# EAGLE design kilafors_rev_B (EAGLE 6.6.0)
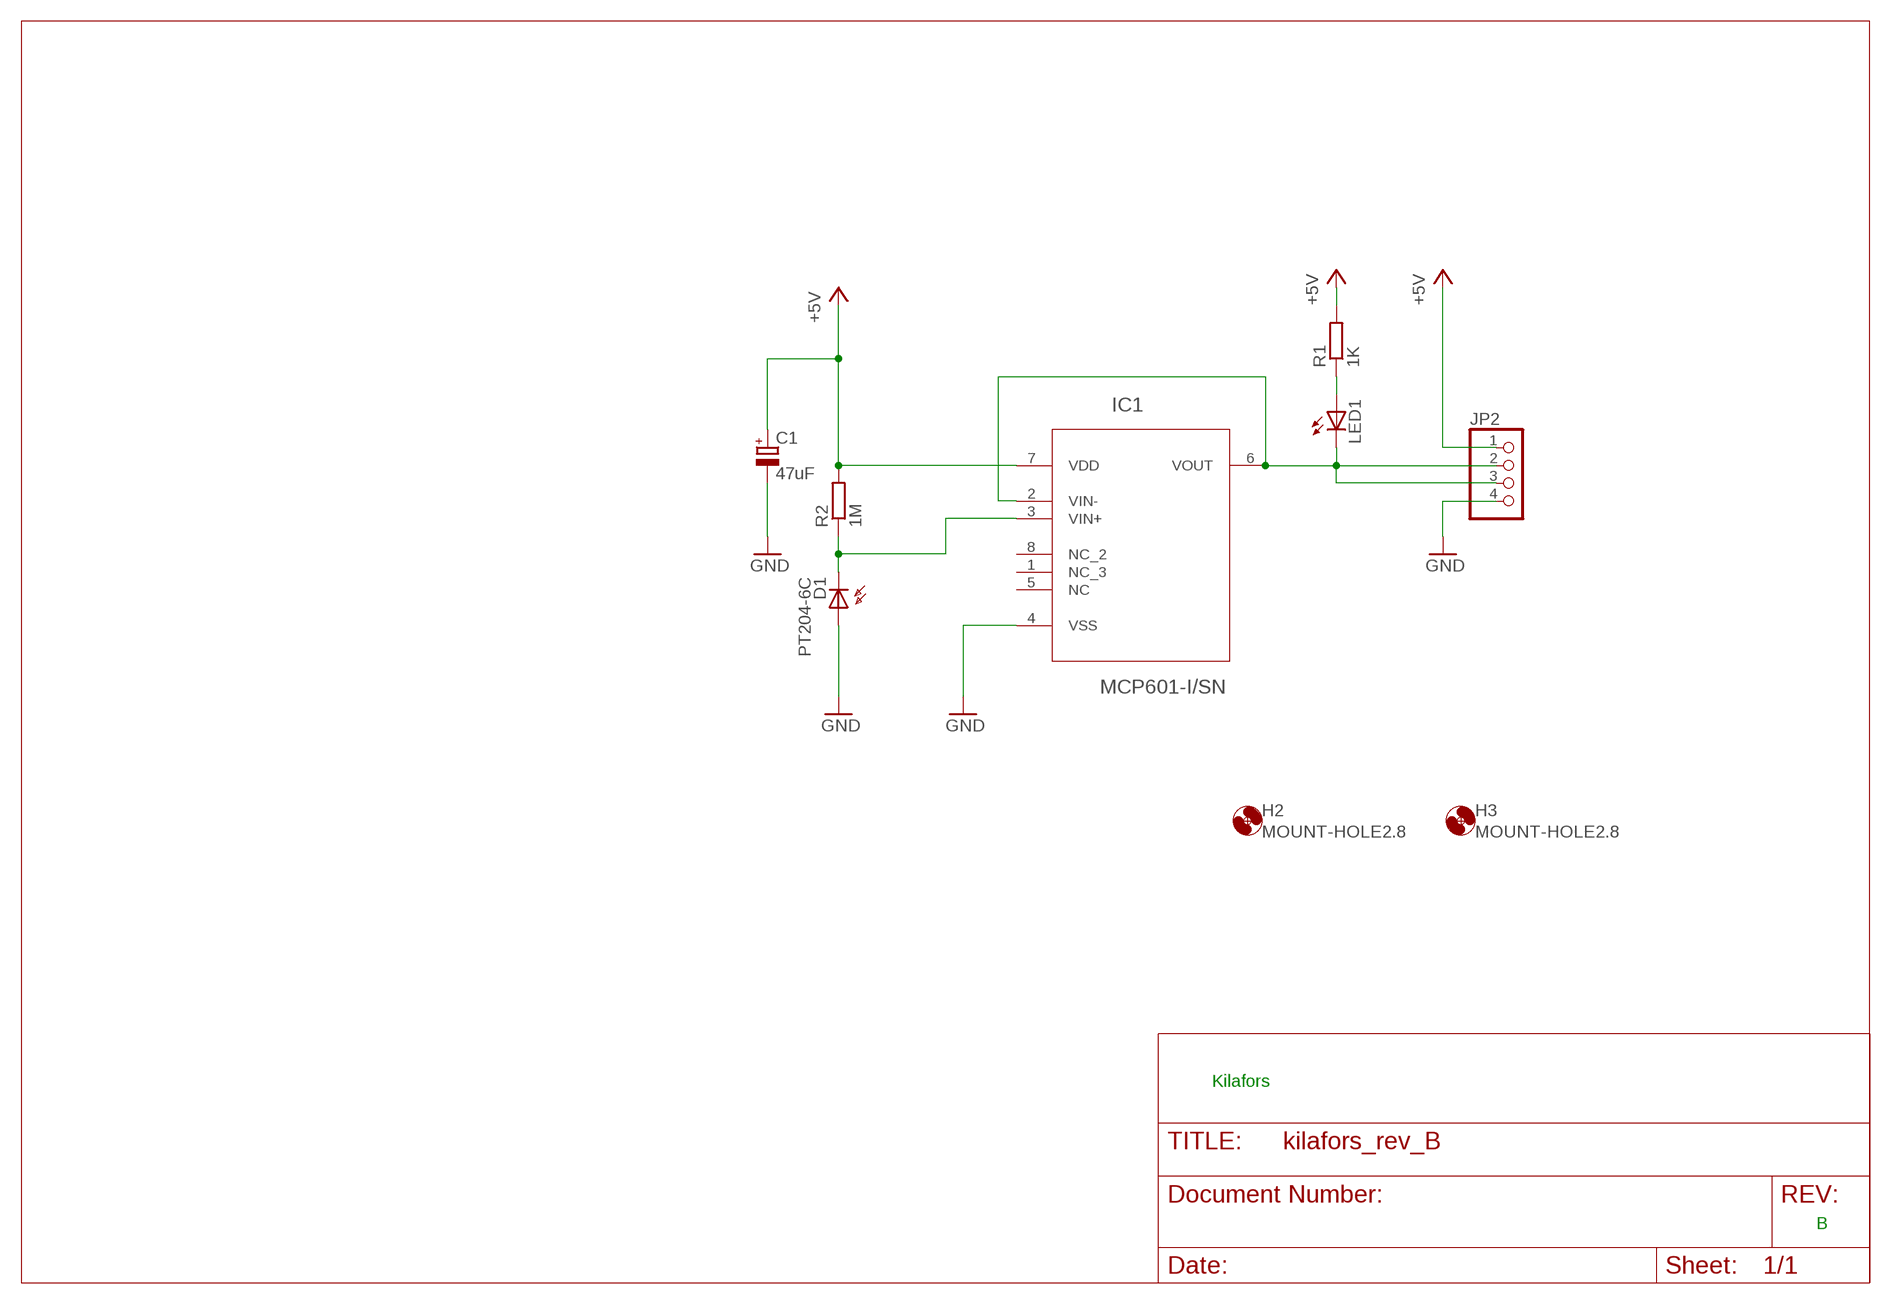
[diagram p0: schematic, sheet 1]

## Parts
C1  47uF  CPOL-EUE5-5  [E5-5]
D1  PT204-6C  BPW32  [BPW32]
H2  MOUNT-HOLE2.8  [2,8]
H3  MOUNT-HOLE2.8  [2,8]
IC1  MCP601-I/SN  [SOIC127P600X175-8N]
JP2  PINHD-1X4  [1X04]
LED1  LED3MM  [LED3MM]
R1  1K  R-EU_0204/5  [0204/5]
R2  1M  R-EU_0204/5  [0204/5]

## Nets
+5V: C1.+ IC1.7(VDD) JP2.1 R1.2 R2.2
GND: C1.- D1.A IC1.4(VSS) JP2.4
N$1: IC1.2(VIN-) IC1.6(VOUT) JP2.2 JP2.3 LED1.K(C)
N$3: D1.K(C) IC1.3(VIN+) R2.1
N$6: LED1.A R1.1
Unconnected: IC1.1(NC_3) IC1.5(NC) IC1.8(NC_2)

## Notes on the sheet
- Kilafors
- B

## Library data of the parts
C1 = rcl:CPOL-EU: POLARIZED CAPACITOR, European symbol
D1 = opto-trans-siemens:BPW32: PHOTO DIODE; OC_FARNELL: unknown; OC_NEWARK: unknown
H2 H3 = holes:MOUNT-HOLE: MOUNTING HOLE with drill center marker
IC1 = mcp601:MCP601-I/SN: CMOS Op Amp; DESCRIPTION: CMOS Op Amps; MPN: MCP601-I/SN; OC_FARNELL: 9758623; OC_NEWARK: 61K2952; PACKAGE: SOIC-8; SUPPLIER: Microchip
JP2 = pinhead:PINHD-1X4: PIN HEADER
LED1 = led:LED: LED OSRAM: - CHIPLED LG R971, LG N971, LY N971, LG Q971, LY Q971, LO R971, LY R971 LH N974, LH R974 LS Q976, LO Q976, LY Q976 LO Q996 - Hyper CHIPLED LW Q18S LB Q993, LB Q99A, LB R99A - SideLED LS A670, LO A670, LY A670, LG A670, LP A670 LB A673, LV A673, LT A673, LW A673 LH A674 LY A675 LS A676, LA A676, LO A676, LY A676, LW A676 LS A679, LY A679, LG A679 - Hyper Micro SIDELED® LS Y876, LA Y876, LO Y876, LY Y876 LT Y87S - SmartLED LW L88C, LW L88S LB L89C, LB L89S, LG L890 LS L89K, LO L89K, LY L89K LS L896, LA L896, LO L896, LY L896 - TOPLED LS T670, LO T670, LY T670, LG T670, LP T670 LSG T670, LSP T670, LSY T670, LOP T670, LYG T670 LG T671, LOG T671, LSG T671 LB T673, LV T673, LT T673, LW T673 LH T674 LS T676, LA T676, LO T676, LY T676, LB T676, LH T676, LSB T676, LW T676 LB T67C, LV T67C, LT T67C, LS T67K, LO T67K, LY T67K, LW E67C LS E67B, LA E67B, LO E67B, LY E67B, LB E67C, LV E67C, LT E67C LW T67C LS T679, LY T679, LG T679 LS T770, LO T770, LY T770, LG T770, LP T770 LB T773, LV T773, LT T773, LW T773 LH T774 LS E675, LA E675, LY E675, LS T675 LS T776, LA T776, LO T776, LY T776, LB T776 LHGB T686 LT T68C, LB T68C - Hyper Mini TOPLED® LB M676 - Mini TOPLED Santana® LG M470 LS M47K, LO M47K, LY M47K Source: http://www.osram.convergy.de LUXEON: - LUMILED® LXK2-PW12-R00, LXK2-PW12-S00, LXK2-PW14-U00, LXK2-PW14-V00 LXK2-PM12-R00, LXK2-PM12-S00, LXK2-PM14-U00 LXK2-PE12-Q00, LXK2-PE12-R00, LXK2-PE12-S00, LXK2-PE14-T00, LXK2-PE14-U00 LXK2-PB12-K00, LXK2-PB12-L00, LXK2-PB12-M00, LXK2-PB14-N00, LXK2-PB14-P00, LXK2-PB14-Q00 LXK2-PR12-L00, LXK2-PR12-M00, LXK2-PR14-Q00, LXK2-PR14-R00 LXK2-PD12-Q00, LXK2-PD12-R00, LXK2-PD12-S00 LXK2-PH12-R00, LXK2-PH12-S00 LXK2-PL12-P00, LXK2-PL12-Q00, LXK2-PL12-R00 Source: www.luxeon.com KINGBRIGHT: KA-3528ASYC Source: www.kingbright.com
R1 R2 = resistor:R-EU_: RESISTOR, European symbol

## Board
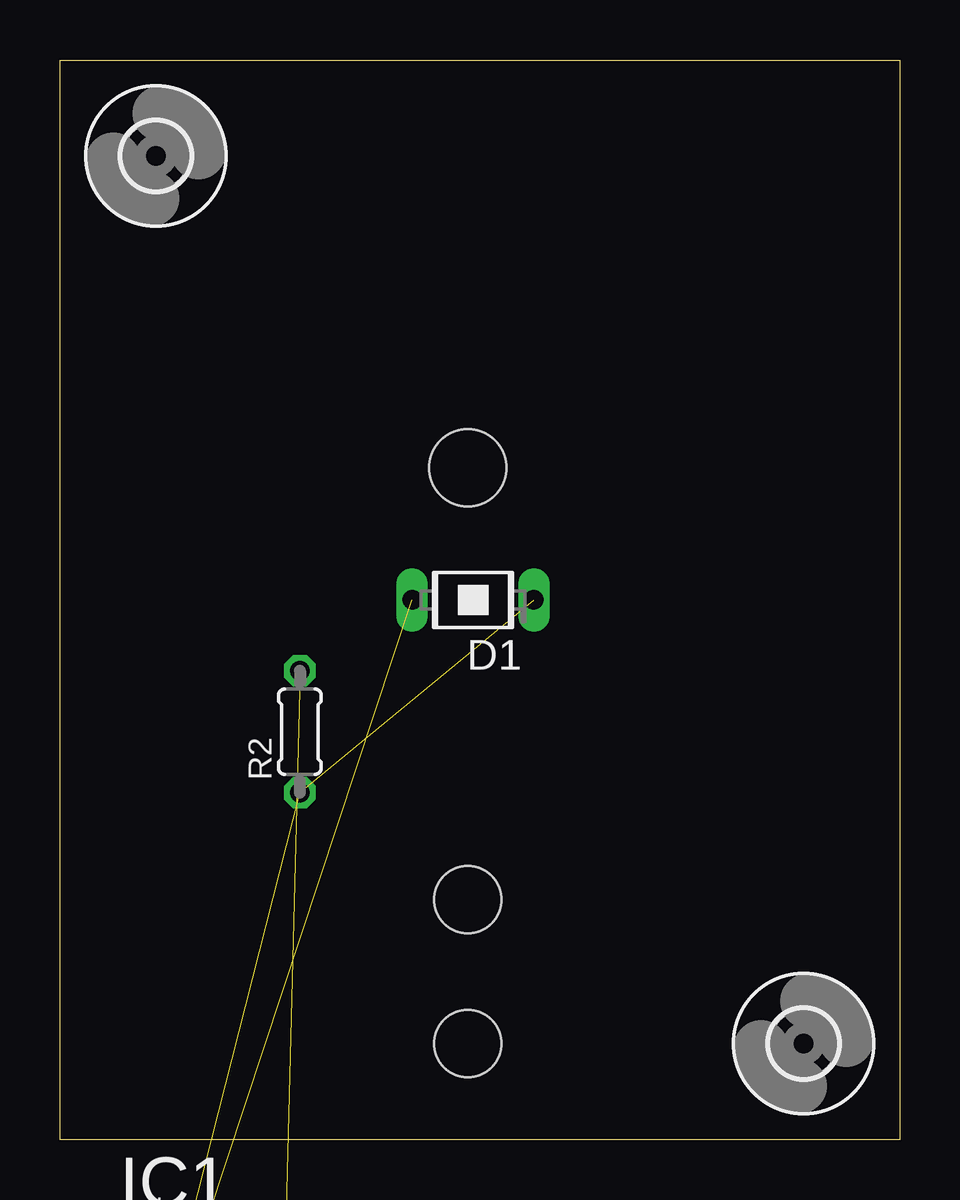
[diagram p1: board, top side]
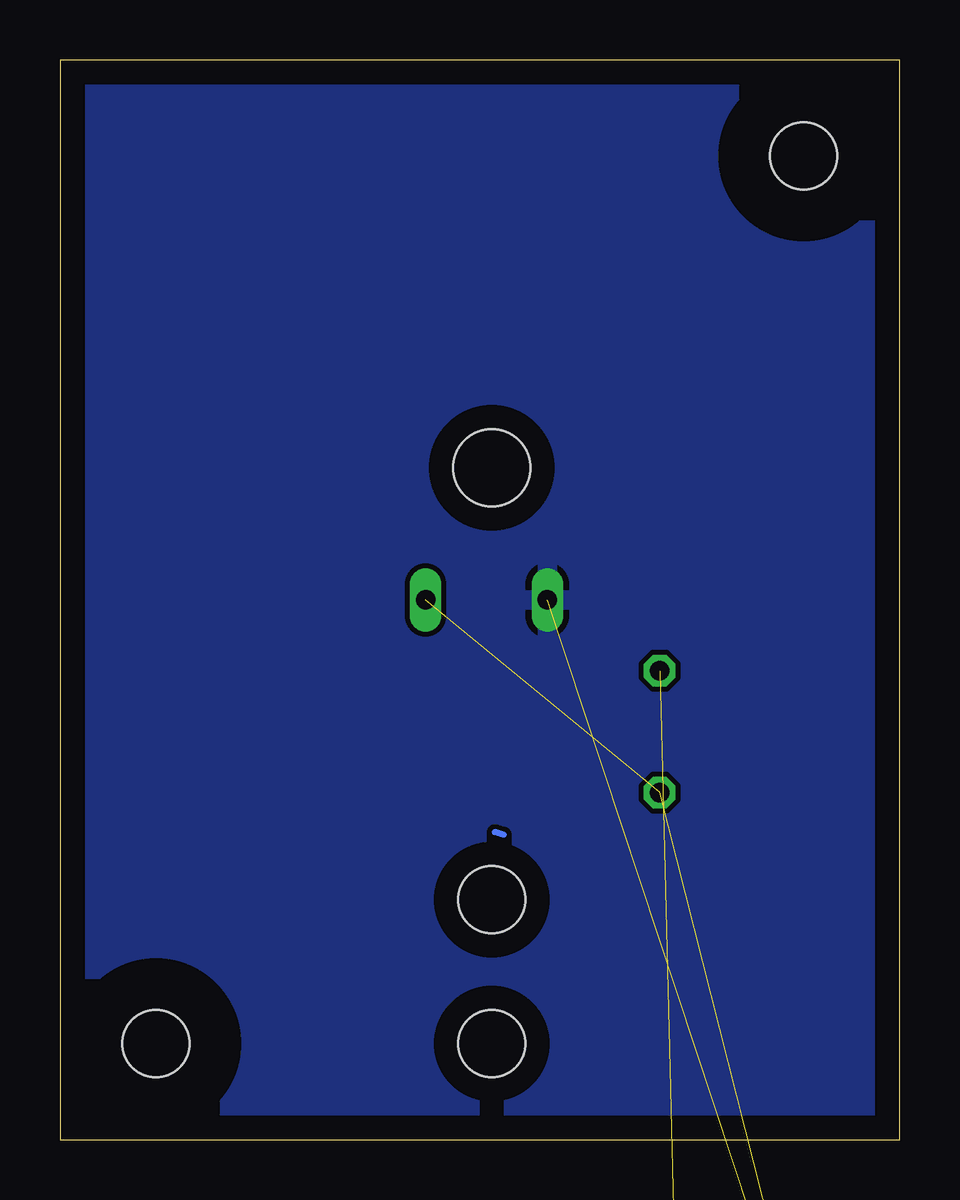
[diagram p2: board, bottom side, seen from below]

Size 35 x 45 mm. Coordinates in mm from the lower left corner, seen from the top.
Outline: 0,0 0,45 35,45 35,0 0,0
Copper layers (1*16): Top 0.035mm / dielectric 1.5mm / Bottom 0.035mm
Design rules "default": minimum track width 10mil, minimum drill 24mil, track to track 8mil, track to pad 8mil, pad to pad 8mil, via to via 8mil, smd to smd 8mil, copper to edge 40mil, drill to drill 8mil, minimum pad ring 10mil, minimum via ring 8mil, stop-mask expansion 4mil, vias tented up to drill 0mil, thermal gap 10mil
Holes 2.8 mm at 17,10 17,4
Holes 3.2 mm at 17,28

### Footprints (pad centres in the part's own frame; a part is rotated, then mirrored left to right if it is on the bottom)
E5-5 = drill 0.813 pad 1.905: + -2.54,0 | drill 0.813 pad 1.905 octagon: - 2.54,0
BPW32 = drill 0.813 long: A 0,2.54; K 0,-2.54
2,8 = hole 2.8: 0,0
SOIC127P600X175-8N = smd 1.981 x 0.559: 1 -2.362,1.905; 2 -2.362,0.635; 3 -2.362,-0.635; 4 -2.362,-1.905; 5 2.362,-1.905; 6 2.362,-0.635; 7 2.362,0.635; 8 2.362,1.905
1X04 = drill 1.016 long: 1 -3.81,0; 2 -1.27,0; 3 1.27,0; 4 3.81,0
LED3MM = drill 0.813 octagon: A -1.27,0; K 1.27,0
0204/5 = drill 0.813 octagon: 1 -2.54,0; 2 2.54,0

### Placement (x,y rotation side)
C1  4,-32 0 top  (outside the outline)
D1  17.22,22.49 90 top
H2  31,4 0 top
H3  4,41 0 top
IC1  7,-6 0 top  (outside the outline)
JP2  6,-26 0 top  (outside the outline)
LED1  3,-20 0 top  (outside the outline)
R1  4,-15 0 top  (outside the outline)
R2  10,17 90 top

### Tracks (layer width: path | path; a pad name or v marks a point on that pad's centre or on a via)
+5V  (4 unrouted)
GND  (3 unrouted)
  pour Bottom: 1,44 1,1 34,1 34,44
N$1  (4 unrouted)
N$3  (2 unrouted)
N$4
  Bottom 0.254: 16.51,12.7 16.88,12.82
N$6  (1 unrouted)

### Text on the board
tValues: Kilafors | Rev A | www.grodansparadis.com